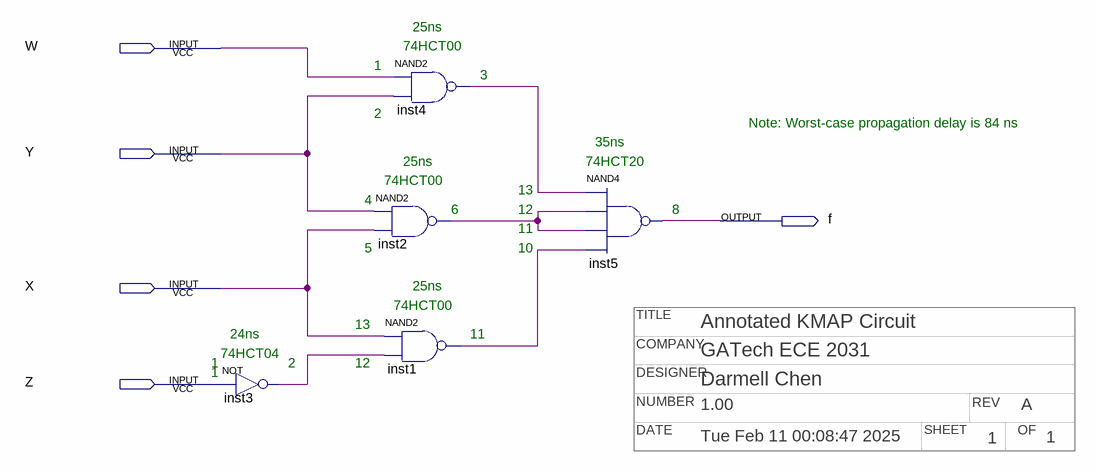
[diagram p0: schematic sheet]
// Quartus schematic Lab2Circuit.bdf as structural Verilog: 5 symbols, 5 pins
// Title block: COMPANY: GATech ECE 2031; DATE: Tue Feb 11 00:08:47 2025; DESIGNER: Darmell Chen; NUMBER: 1.00; OF: 1; REV: A; SHEET: 1; TITLE: Annotated KMAP Circuit
module Lab2Circuit (
  input  W,
  input  Y,
  input  X,
  input  Z,
  output f
);

  wire inst1_out, inst2_out, inst3_out, inst4_out;

  not inst3 (inst3_out, Z);
  nand inst2 (inst2_out, Y, X);
  nand inst4 (inst4_out, W, Y);
  nand inst1 (inst1_out, X, inst3_out);
  nand inst5 (f, inst4_out, inst2_out, inst2_out, inst1_out);

  // Notes on the sheet:
  //   25ns
  //   74HCT00
  //   1
  //   3
  //   2
  //   Note: Worst-case propagation delay is 84 ns
  //   35ns
  //   25ns
  //   74HCT20
  //   74HCT00
  //   13
  //   4
  //   6
  //   12
  //   8
  //   11
  //   5
  //   10
  //   25ns
  //   74HCT00
  //   13
  //   24ns
  //   11
  //   74HCT04
  //   1
  //   2
  //   12
  //   1
endmodule
